# Altium project WaffleCharger.PrjPcb
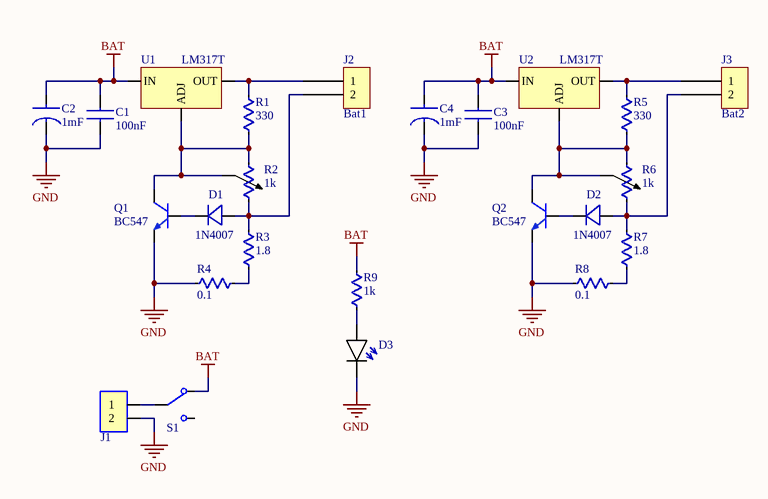
[diagram p0: PCB.SchDoc]
1 sheet, 24 parts. Net scope: global (net labels, ports and power ports of the same name join across sheets).
Board file: PCB.PcbDoc

## Sheet PCB.SchDoc
size A4

### Parts
C1  value 100nF  [CAP-CER]  (hidden comment: CAP-CER)
C2  value 1mF  [CAP-ELEC-5x11x2mm]  (hidden comment: CAP-ELEC)
C3  value 100nF  [CAP-CER]  (hidden comment: CAP-CER)
C4  value 1mF  [CAP-ELEC-5x11x2mm]  (hidden comment: CAP-ELEC)
D1  1N4007  [DO-41 VERTICAL]
D2  1N4007  [DO-41 VERTICAL]
D3  LED  [LED-3MM-RED]  (value not drawn)
J1  2-BLOCK_TERMINAL  [BLOCK_TERMINAL-2]  (value not drawn)
J2  Bat1  [HEADER 1x2]
J3  Bat2  [HEADER 1x2]
Q1  BC547  [TO-92]
Q2  BC547  [TO-92]
R1  value 330  [RES VERTICAL]  (hidden comment: RES)
R2  value 1k  [TRIMPOT]  (hidden comment: POT)
R3  value 1.8  [RES VERTICAL]  (hidden comment: RES)
R4  value 0.1  [RES-Axial-400mil]  (hidden comment: RES)
R5  value 330  [RES VERTICAL]  (hidden comment: RES)
R6  value 1k  [TRIMPOT]  (hidden comment: POT)
R7  value 1.8  [RES VERTICAL]  (hidden comment: RES)
R8  value 0.1  [RES-Axial-400mil]  (hidden comment: RES)
R9  value 1k  [RES VERTICAL]  (hidden comment: RES)
S1  SLIDE-SWITCH  [SWITCH]  (value not drawn)
U1  LM317T  [TO-220]
U2  LM317T  [TO-220]

### Nets
BAT: C1.2 C2.1 C3.2 C4.1 R9.2 S1.1 U1.1(IN) U2.1(IN)
GND: C1.1 C2.2 C3.1 C4.2 D3.K J1.2 Q1.E Q2.E R4.1 R8.1
NetD1_A: D1.A J2.2 R2.1 R3.2
NetD1_K: D1.K Q1.B
NetD2_A: D2.A J3.2 R6.1 R7.2
NetD2_K: D2.K Q2.B
NetD3_A: D3.A R9.1
NetJ1_1: J1.1 S1.2
NetJ2_1: J2.1 R1.2 U1.3(OUT)
NetJ3_1: J3.1 R5.2 U2.3(OUT)
NetQ1_C: Q1.C R1.1 R2.2 R2.3 U1.2(ADJ)
NetQ2_C: Q2.C R5.1 R6.2 R6.3 U2.2(ADJ)
NetR3_1: R3.1 R4.2
NetR7_1: R7.1 R8.2

Not connected (* = marked no-connect by the designer): S1 3

### Library data of the parts
D1 D2 = DIODE: NAME: 1N4007
J2 J3 = Header 1x2
Q1 Q2 = NPN
U1 U2 = LM317